# EasyEDA schematic soap-disp-mega-16.json

## Sheets
1 Computer: TITLE: Sheet_1; REV: 1.0; Date: 2021-05-28; Sheet: 1/1; Drawn By: Suresh Kumar Gadi; Company: Your Company
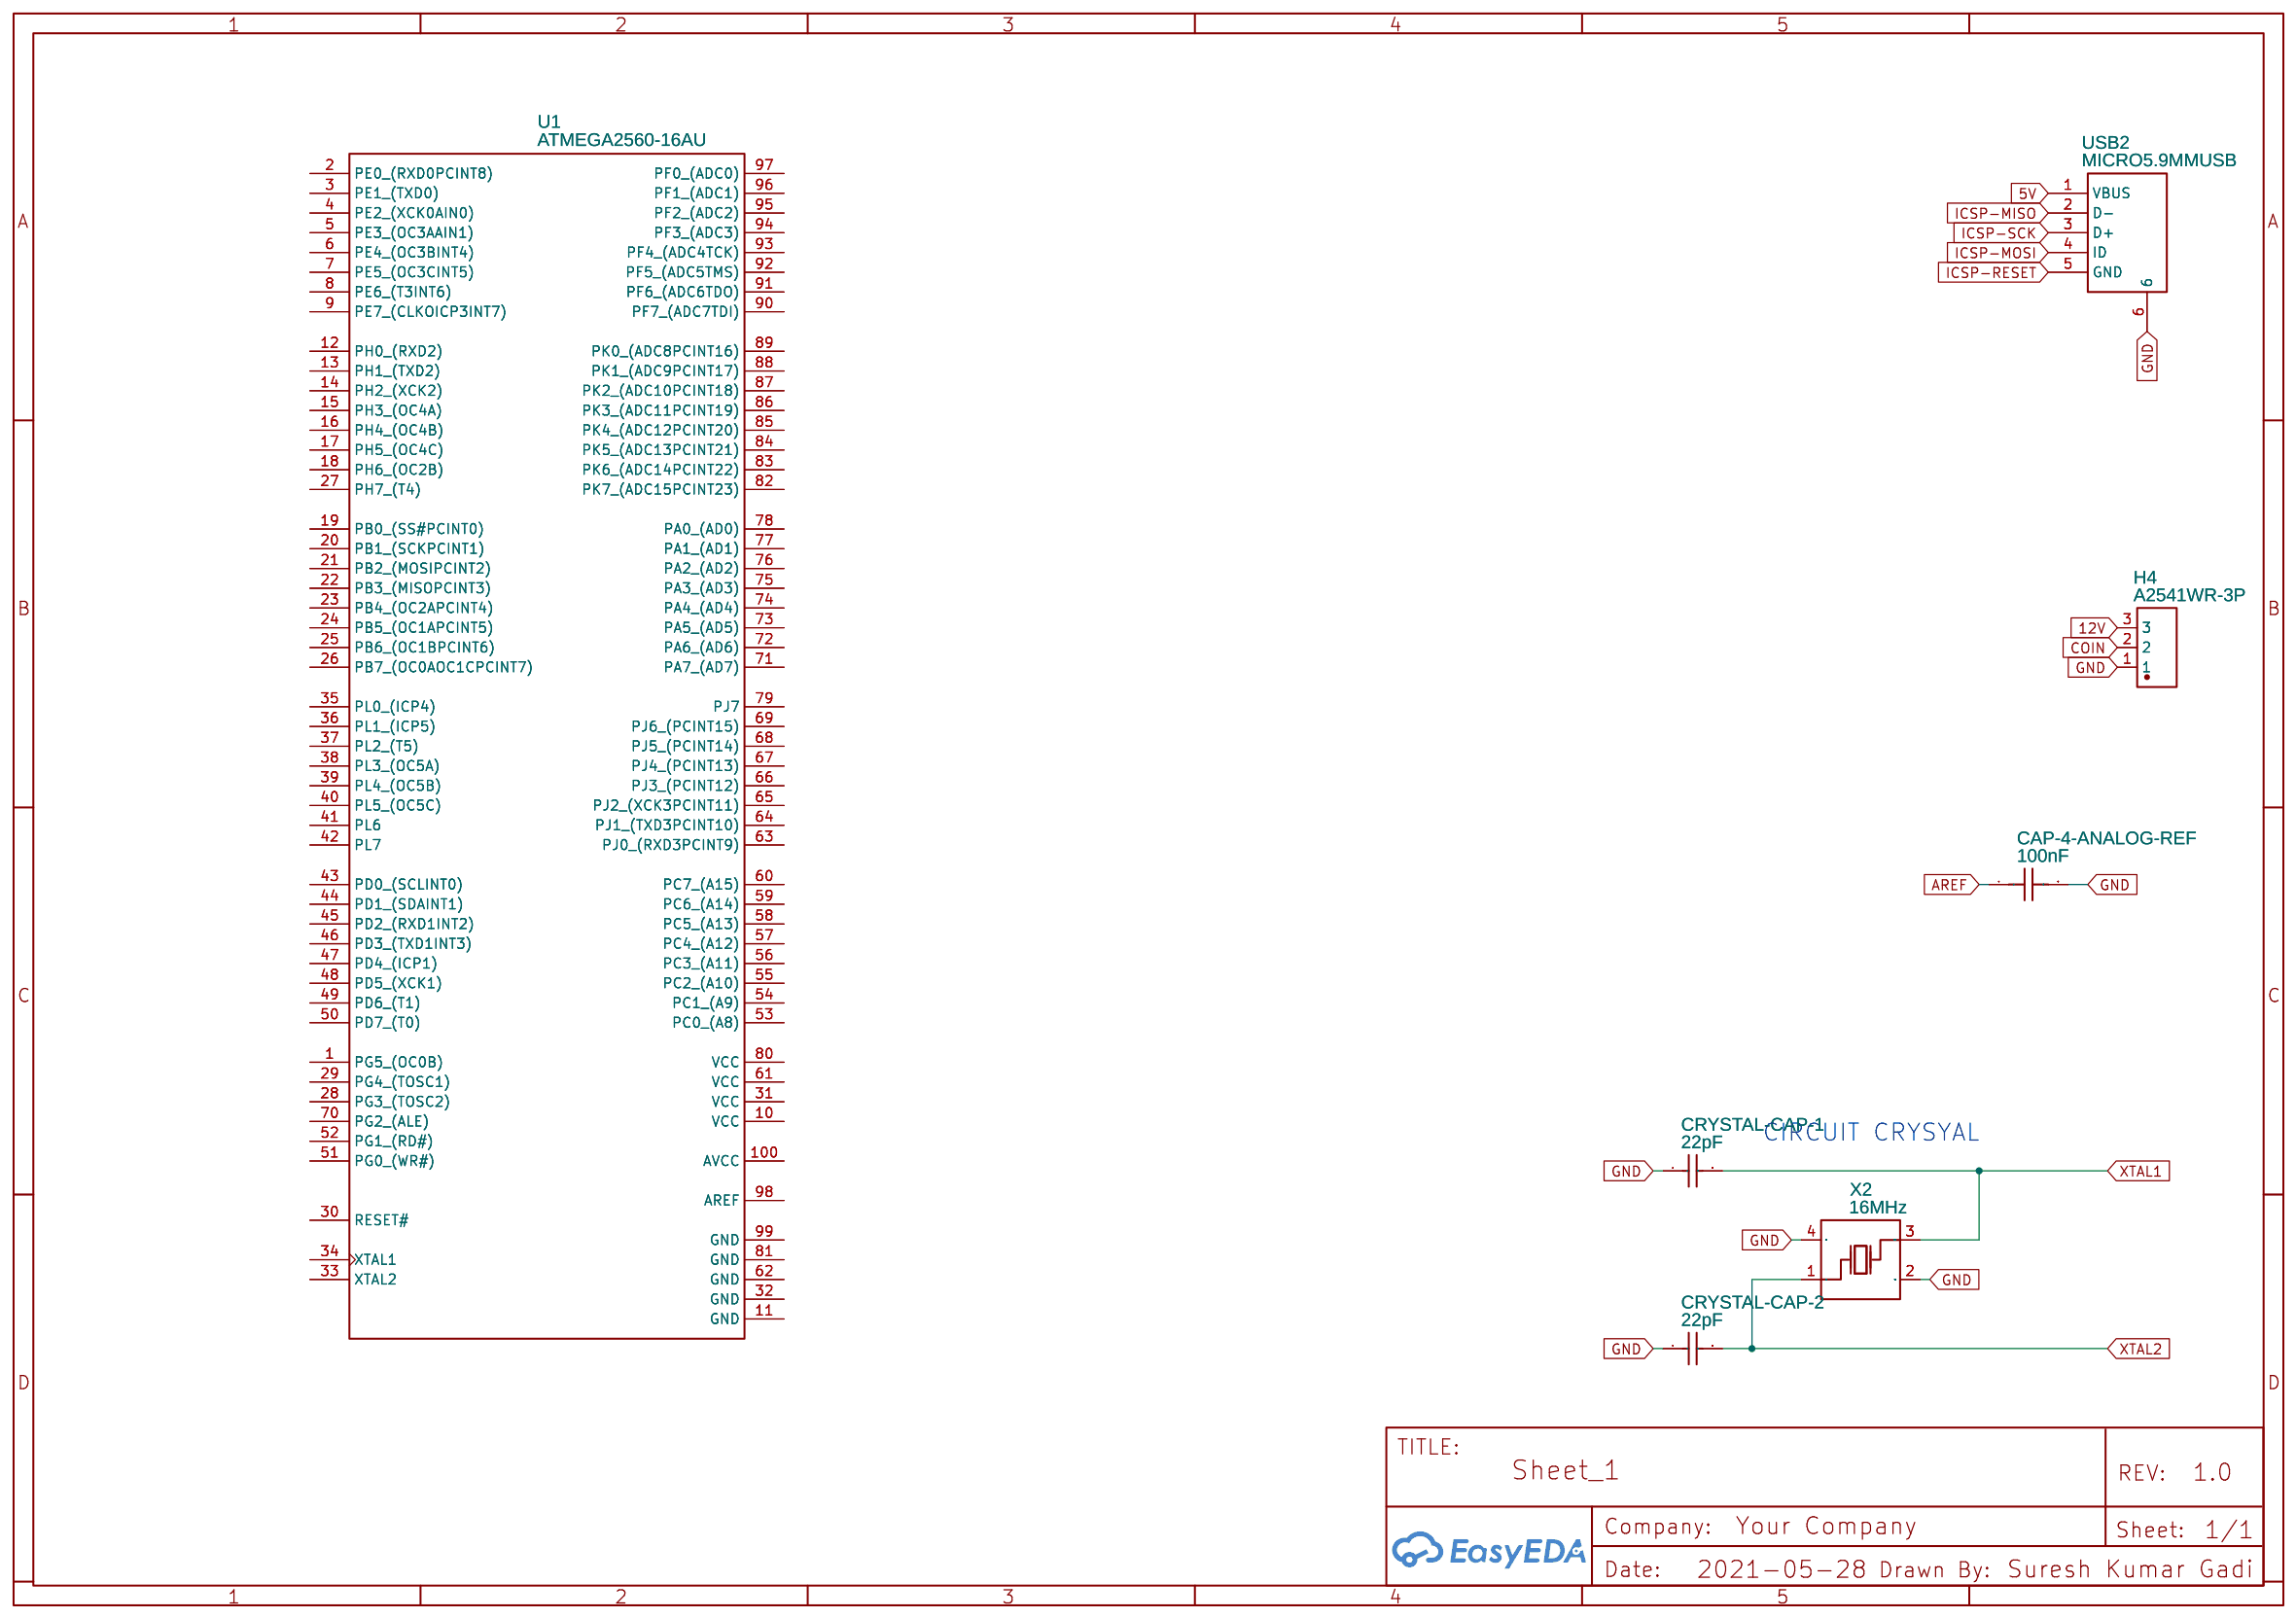
[diagram p0: Computer]
2 Connectors
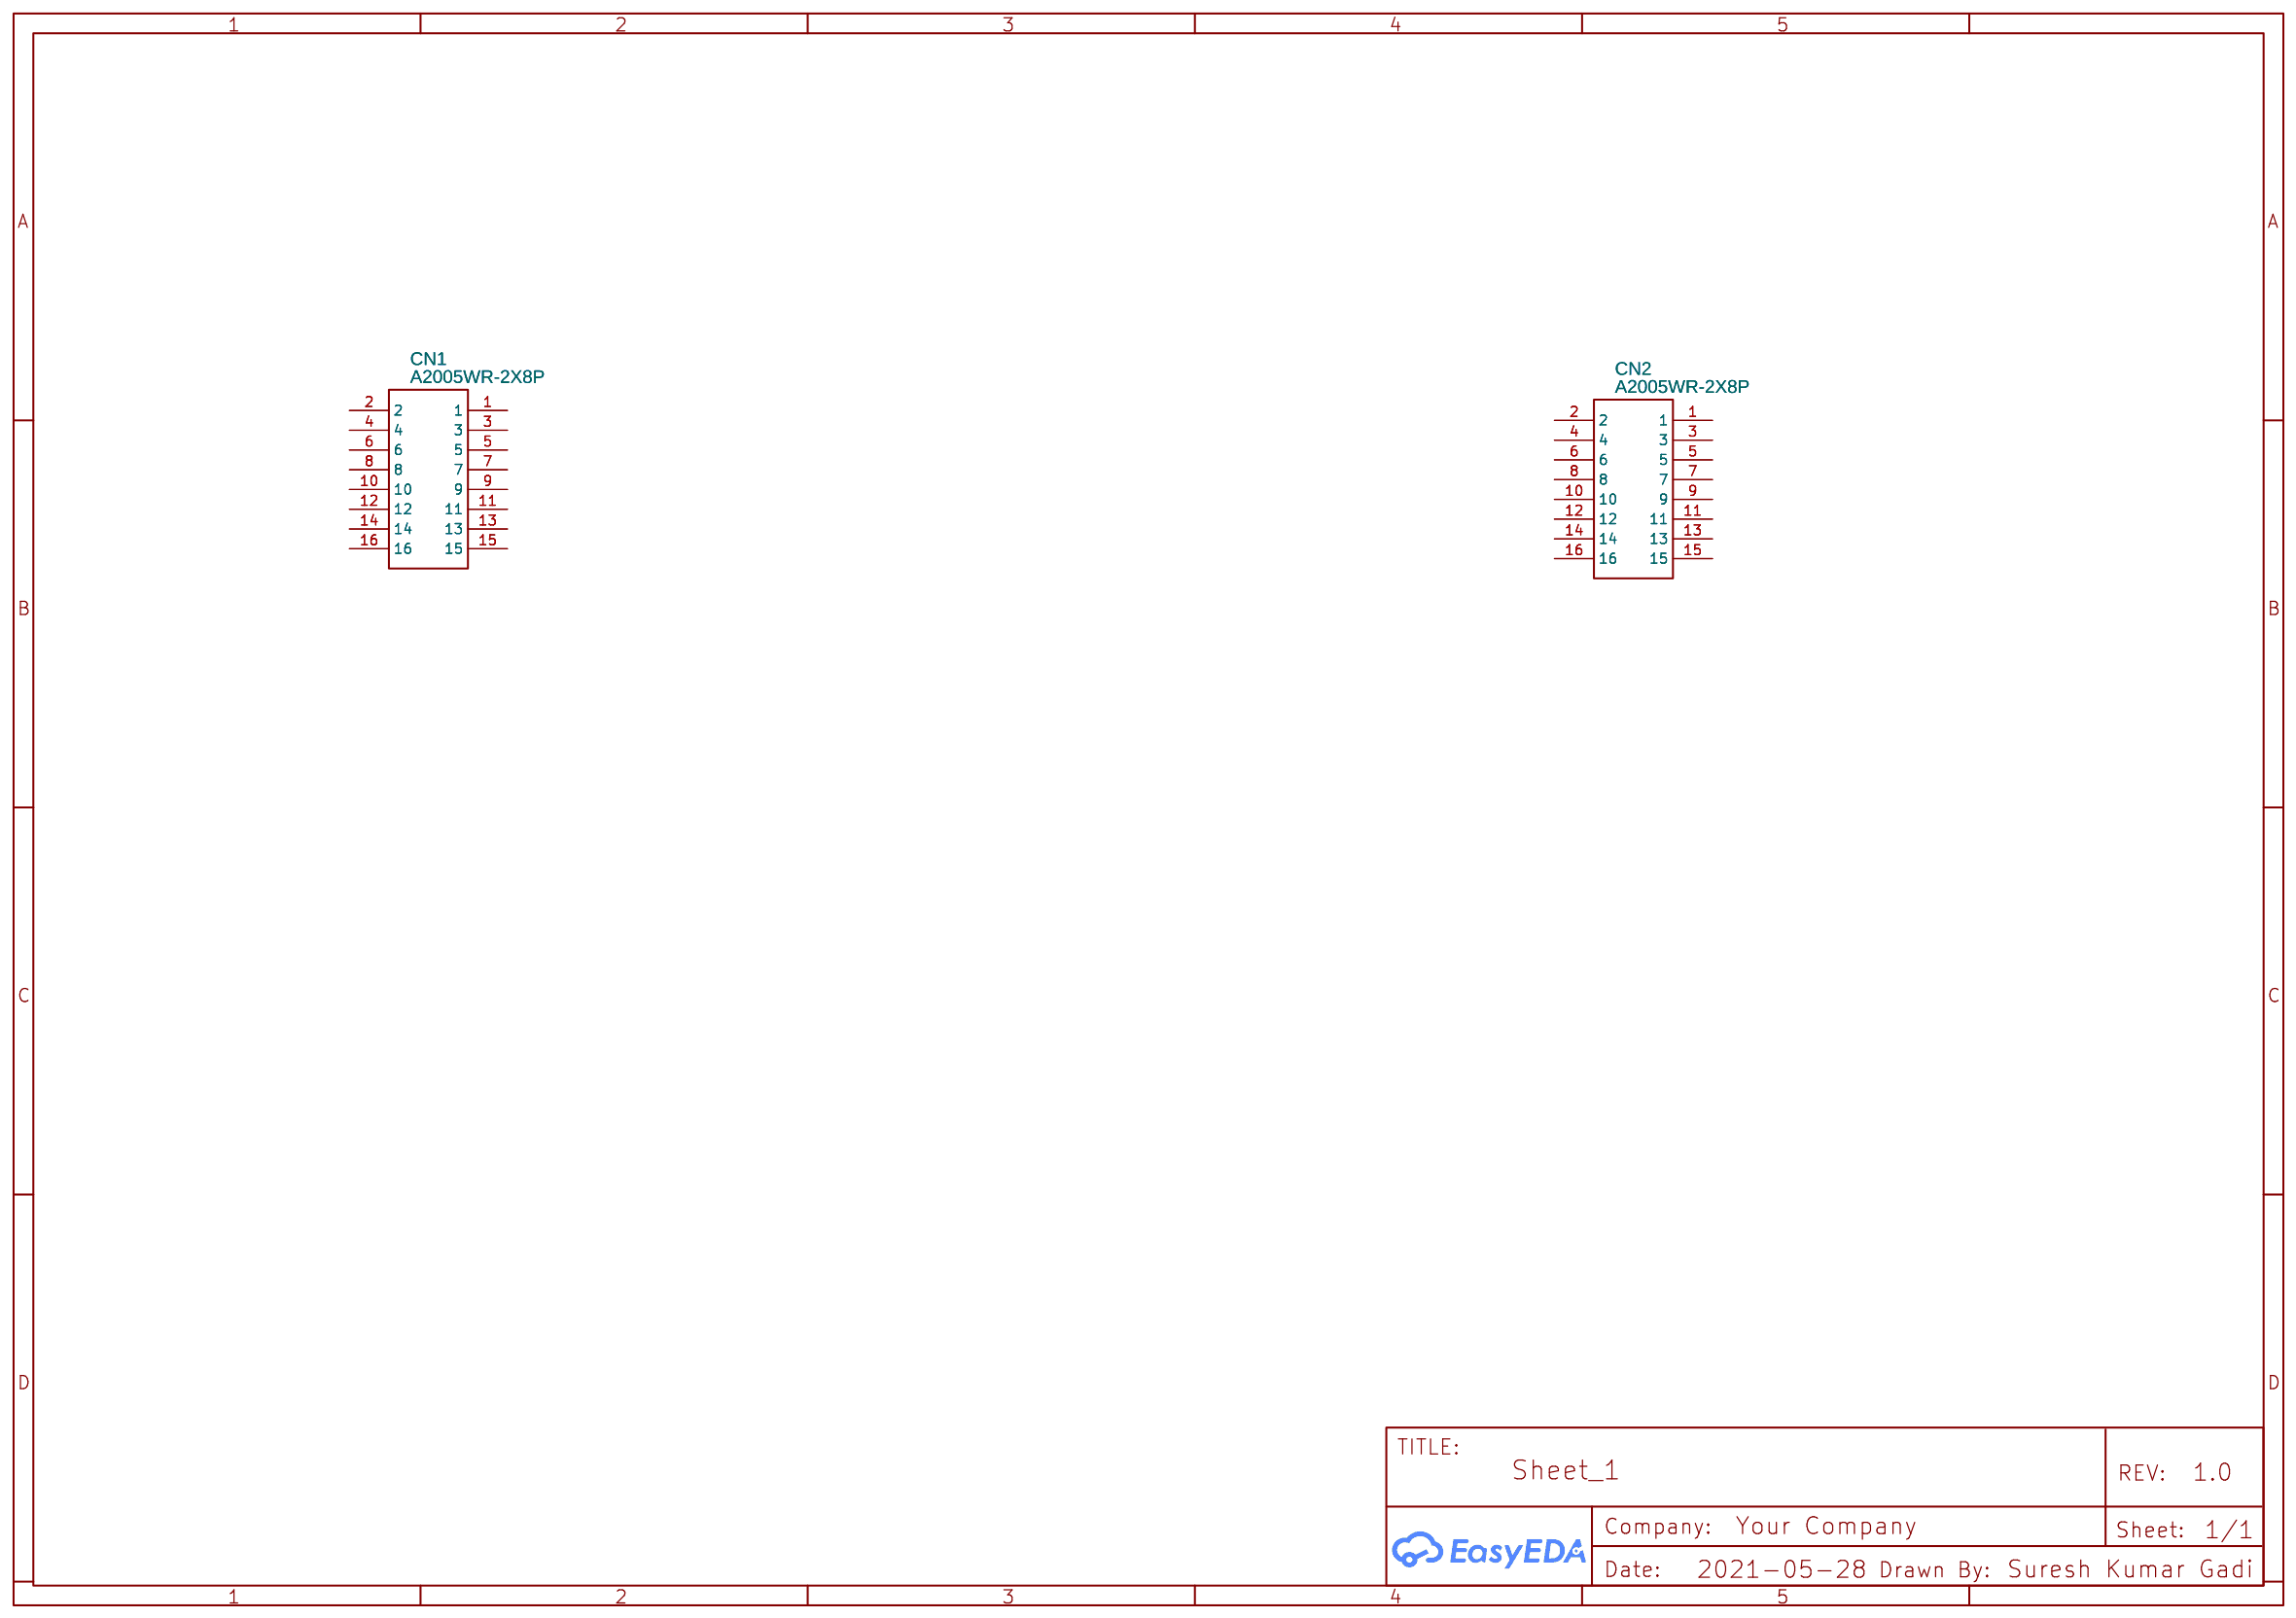
[diagram p1: Connectors]
3 SD
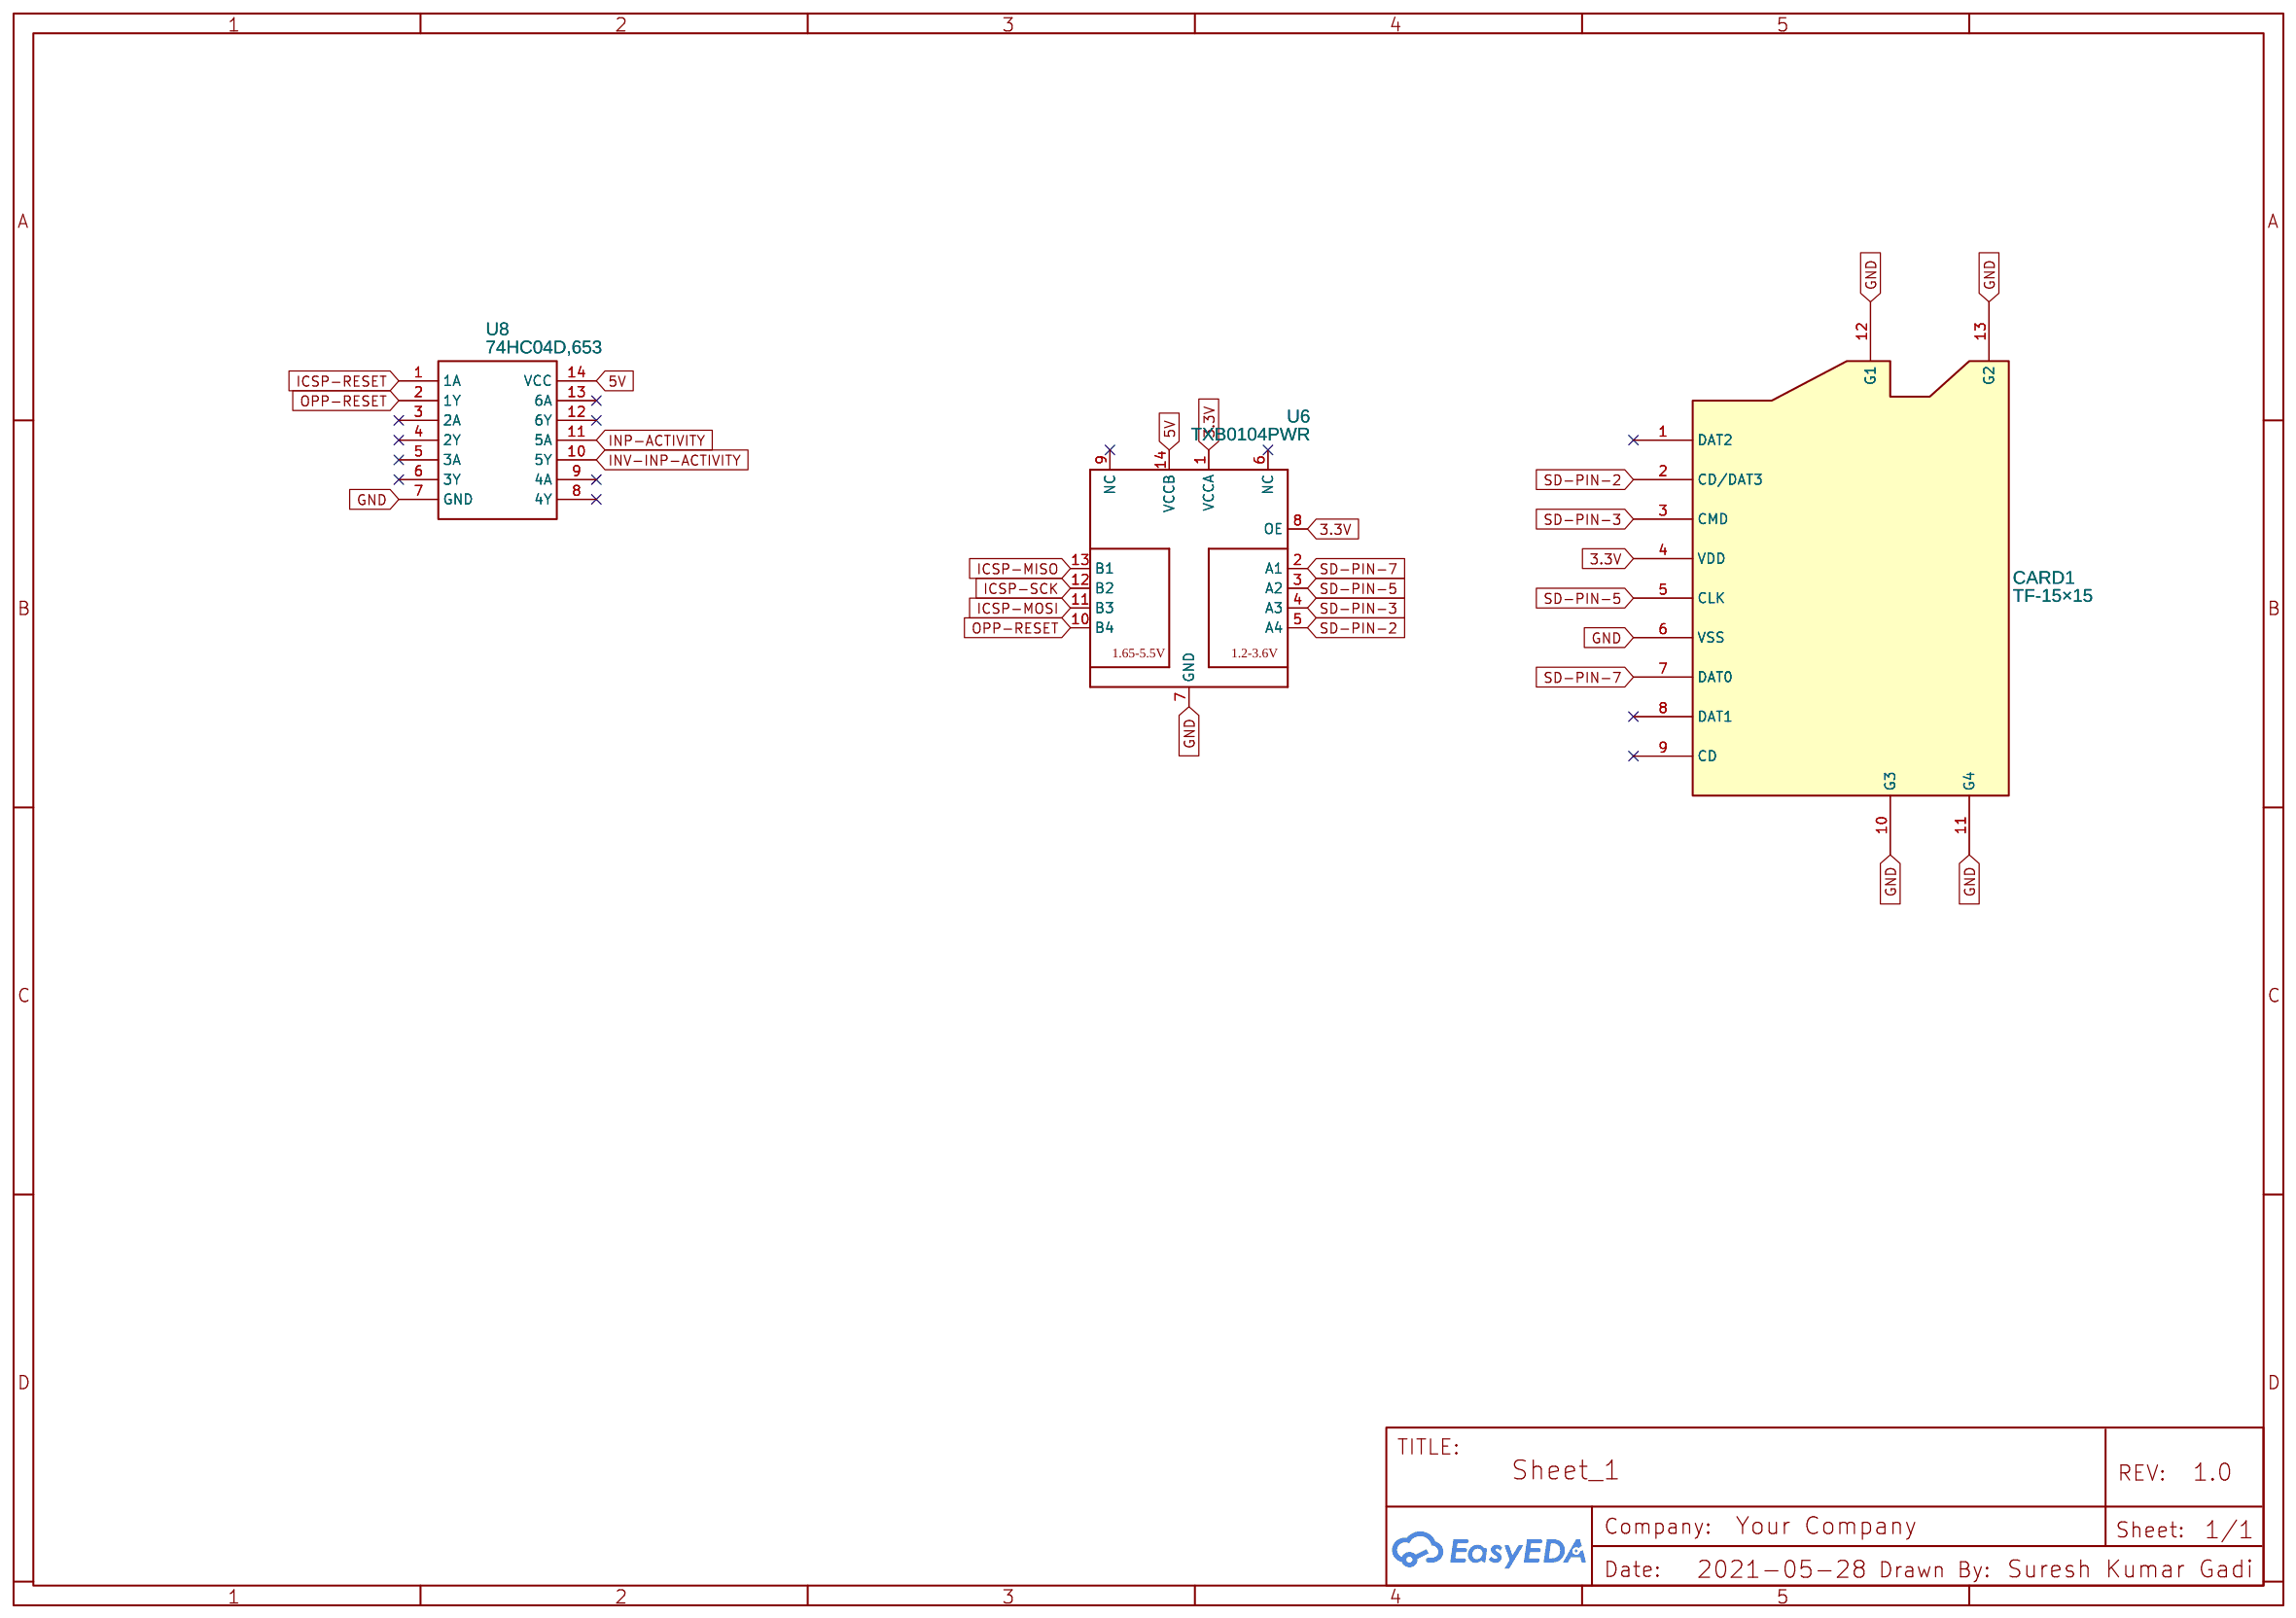
[diagram p2: SD]
4 Power
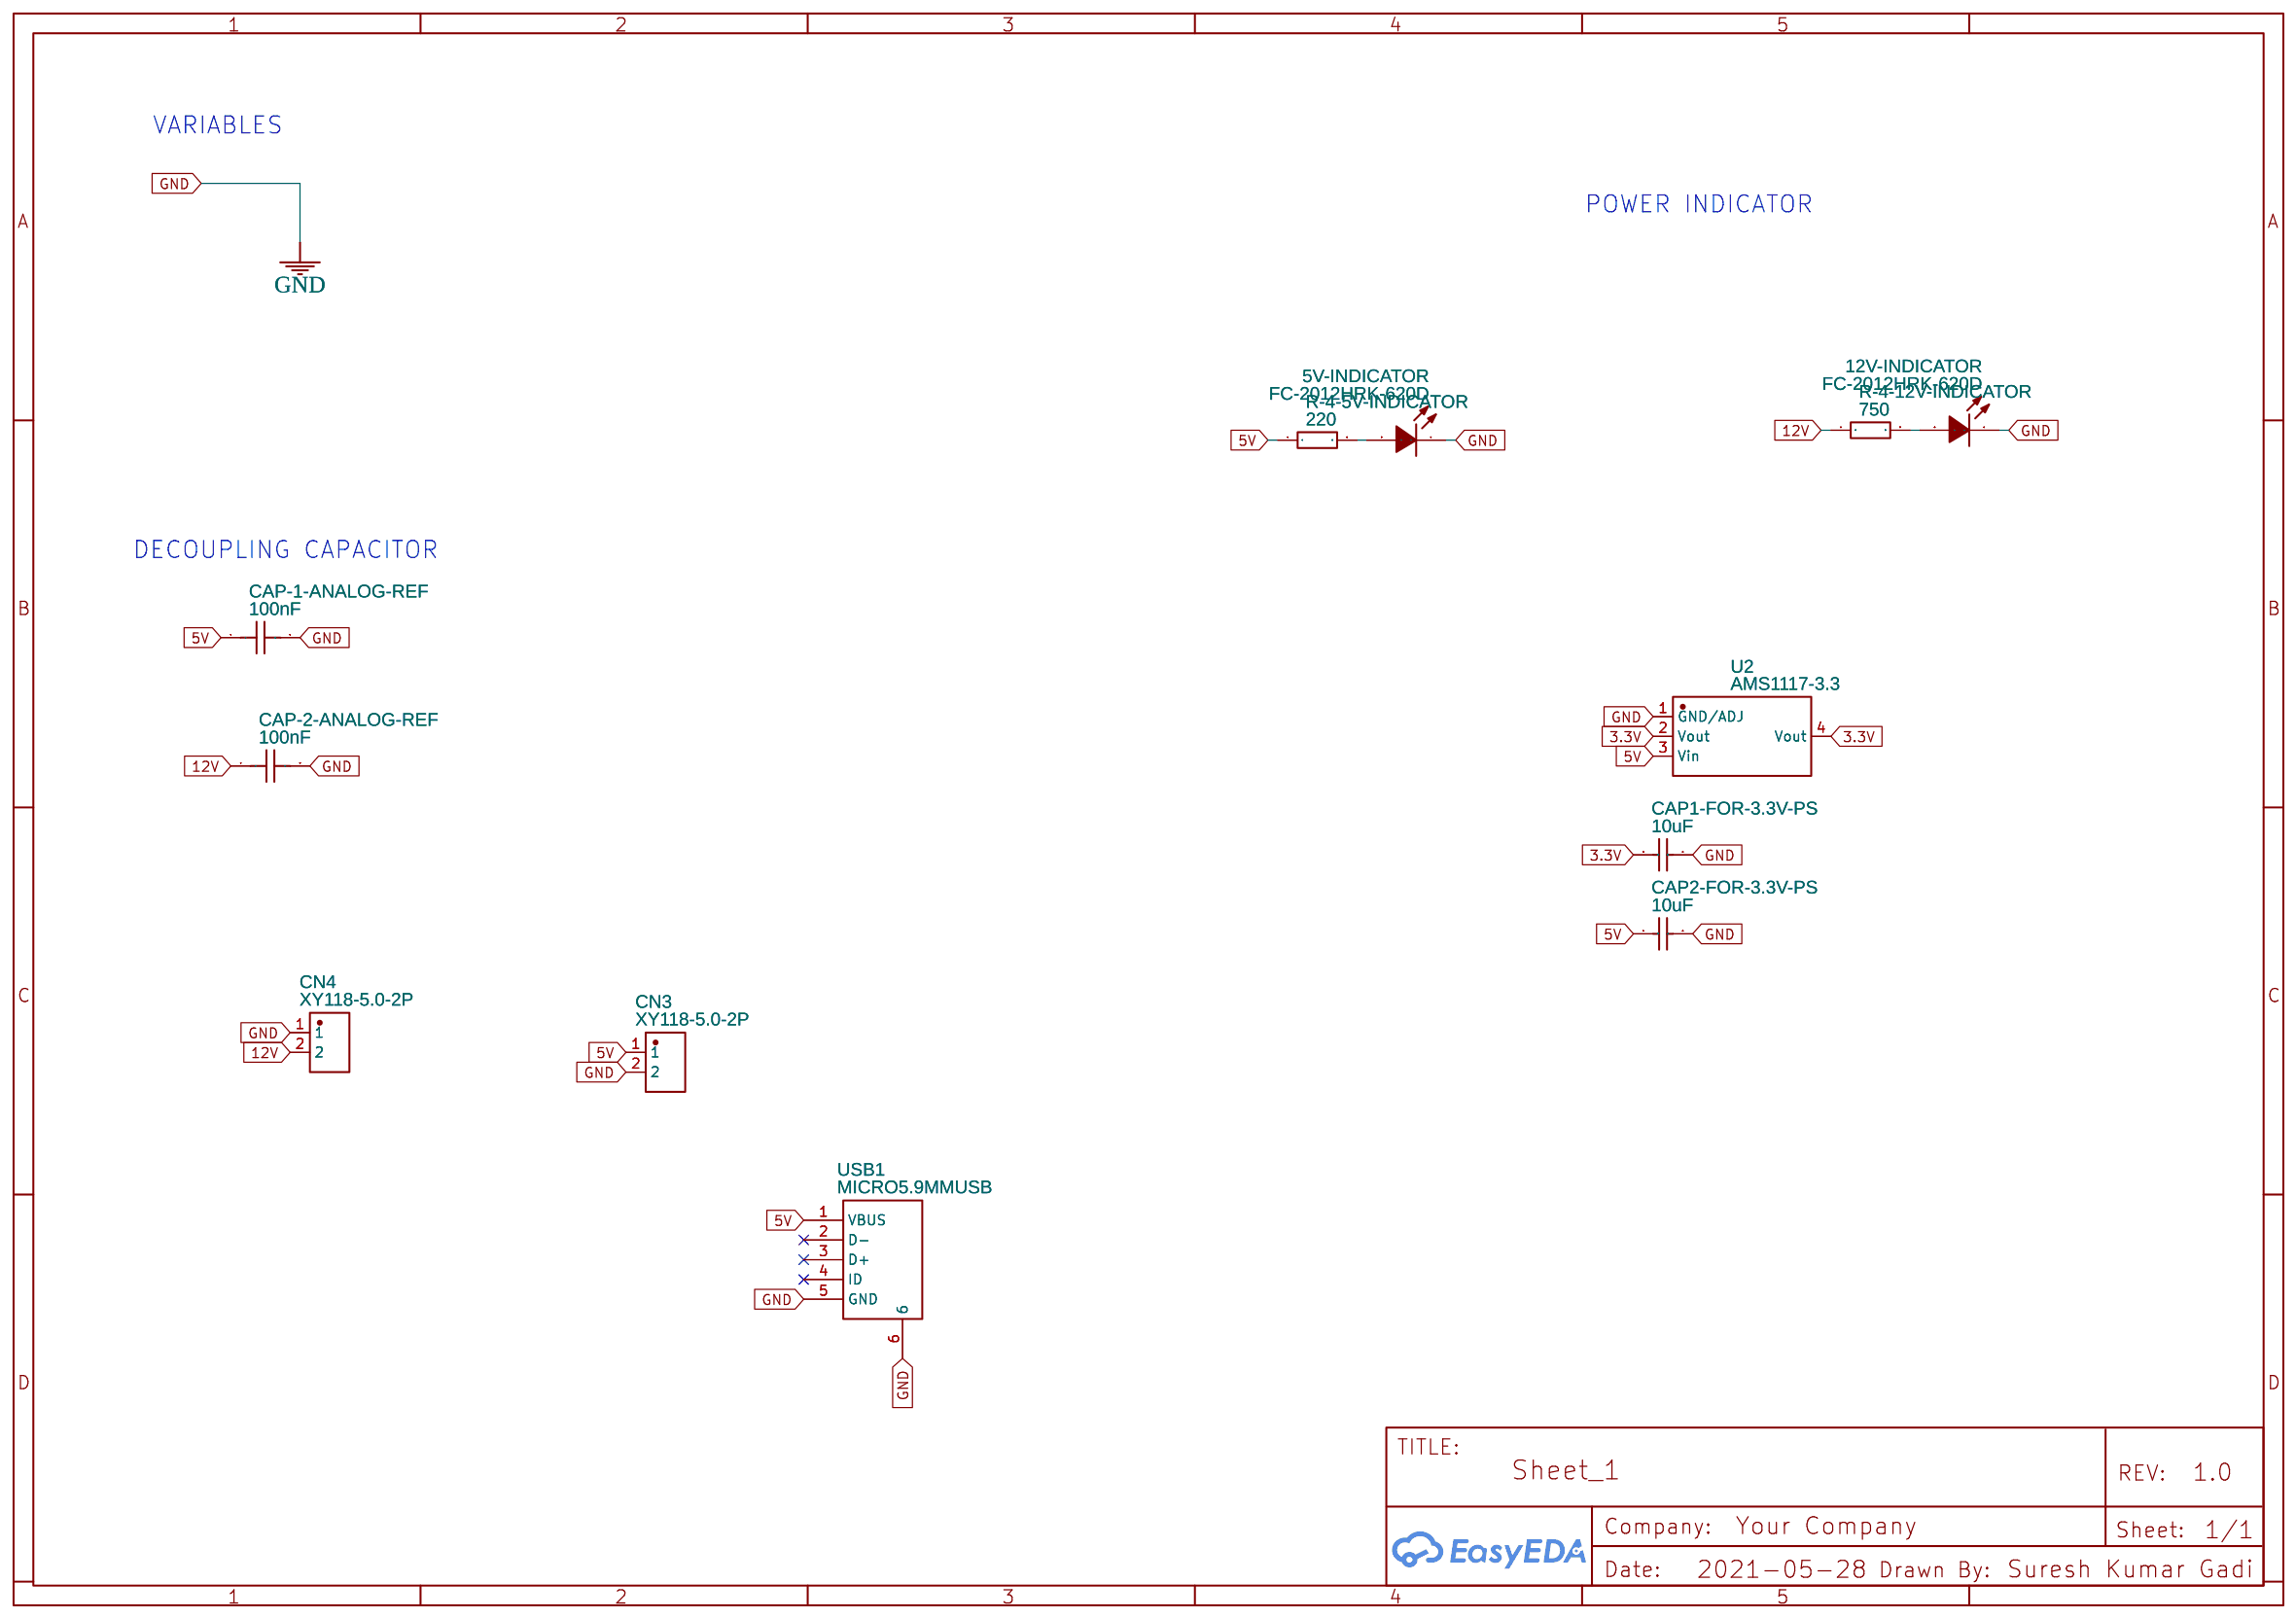
[diagram p3: Power]
5 Capacitors
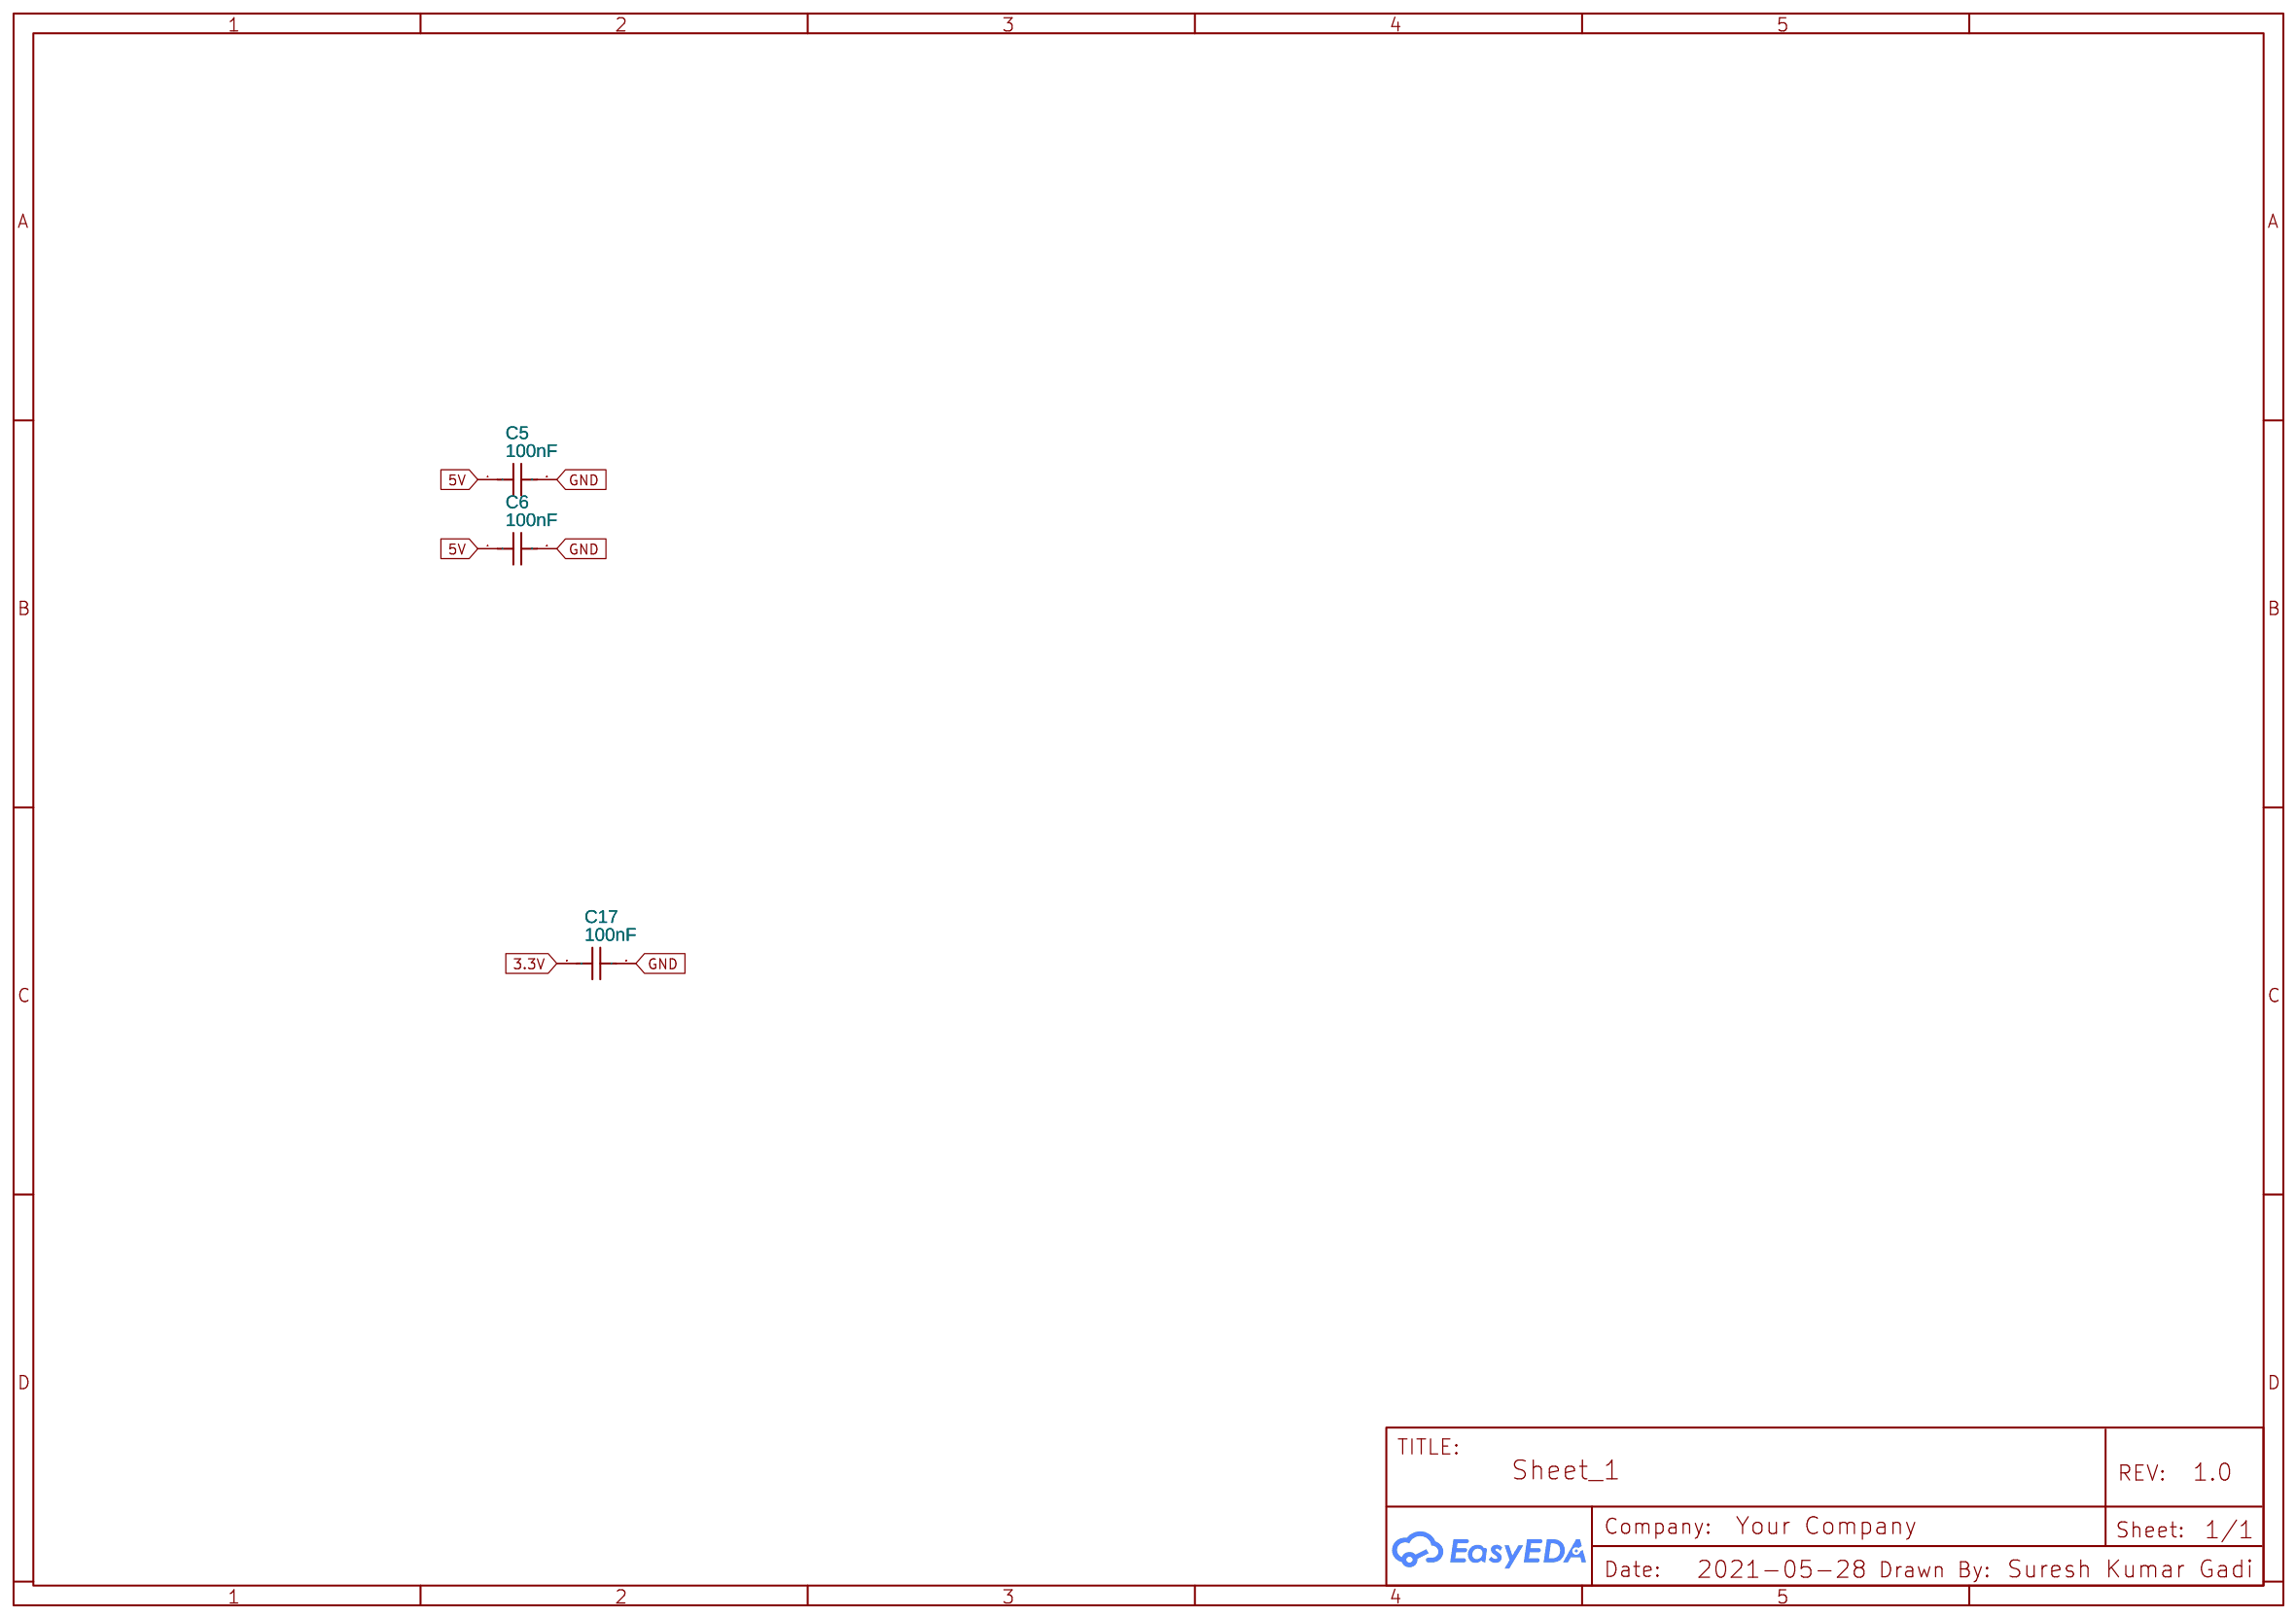
[diagram p4: Capacitors]
6 Display
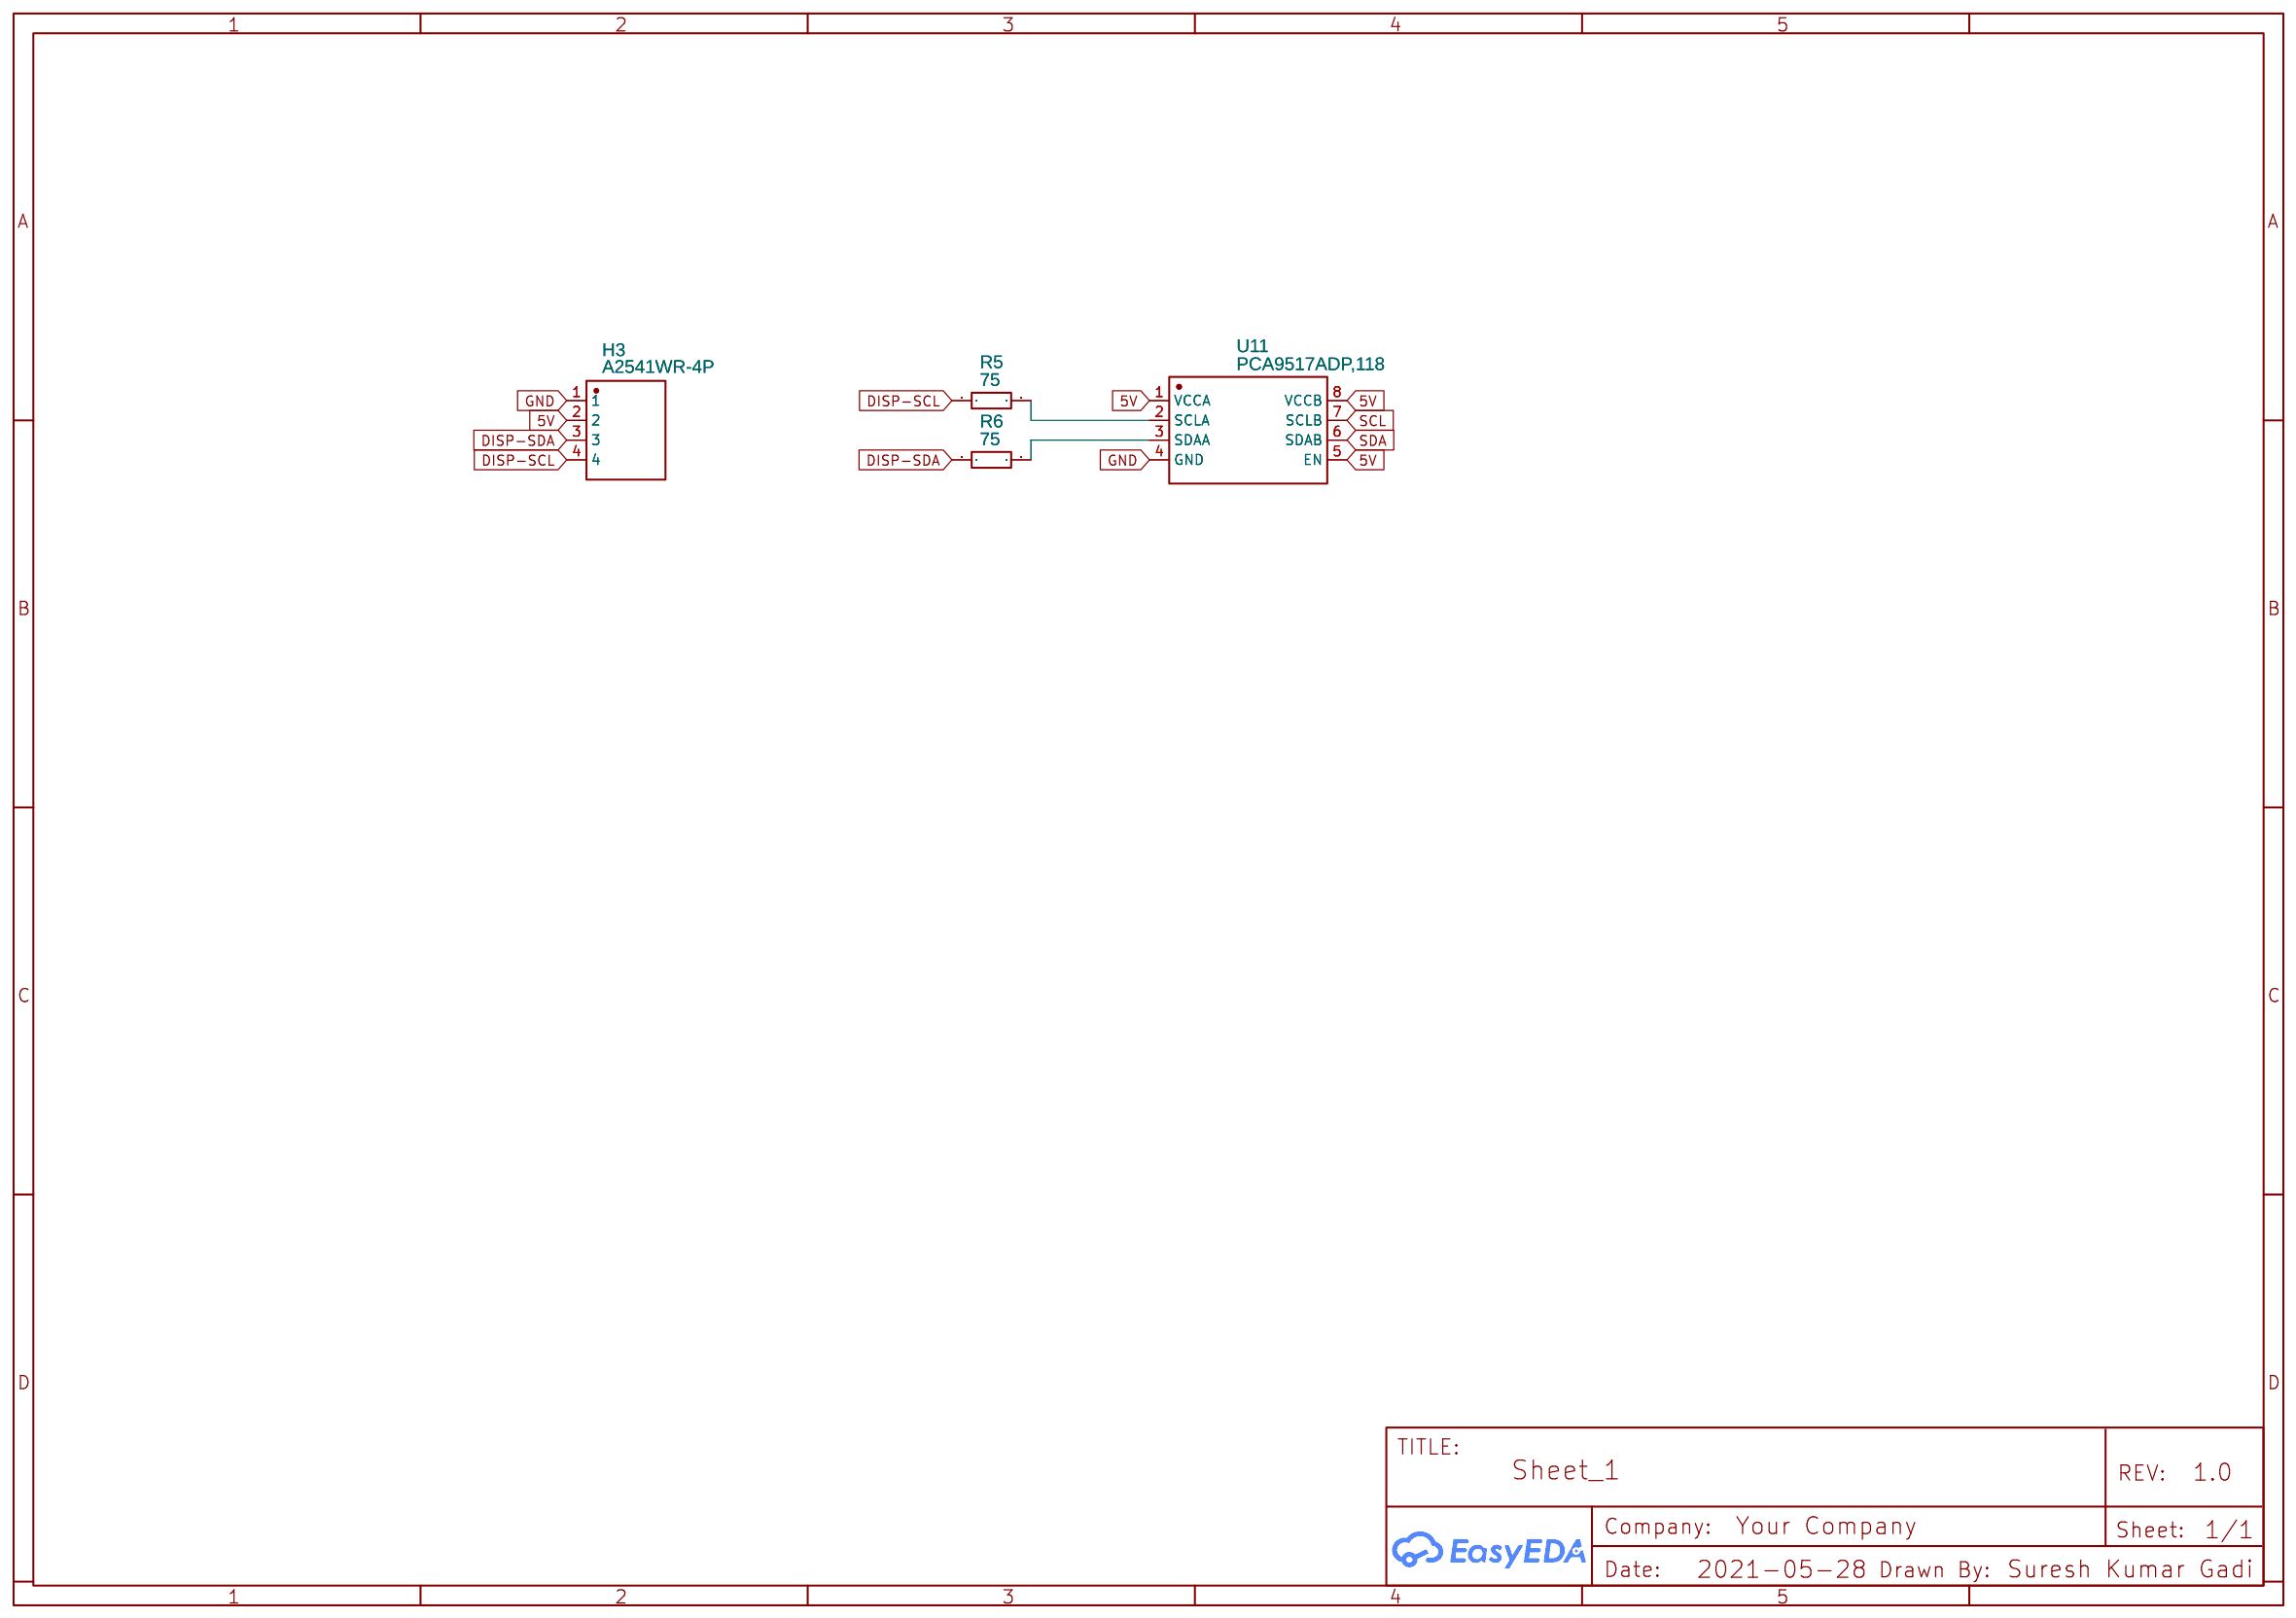
[diagram p5: Display]
7 LEDs
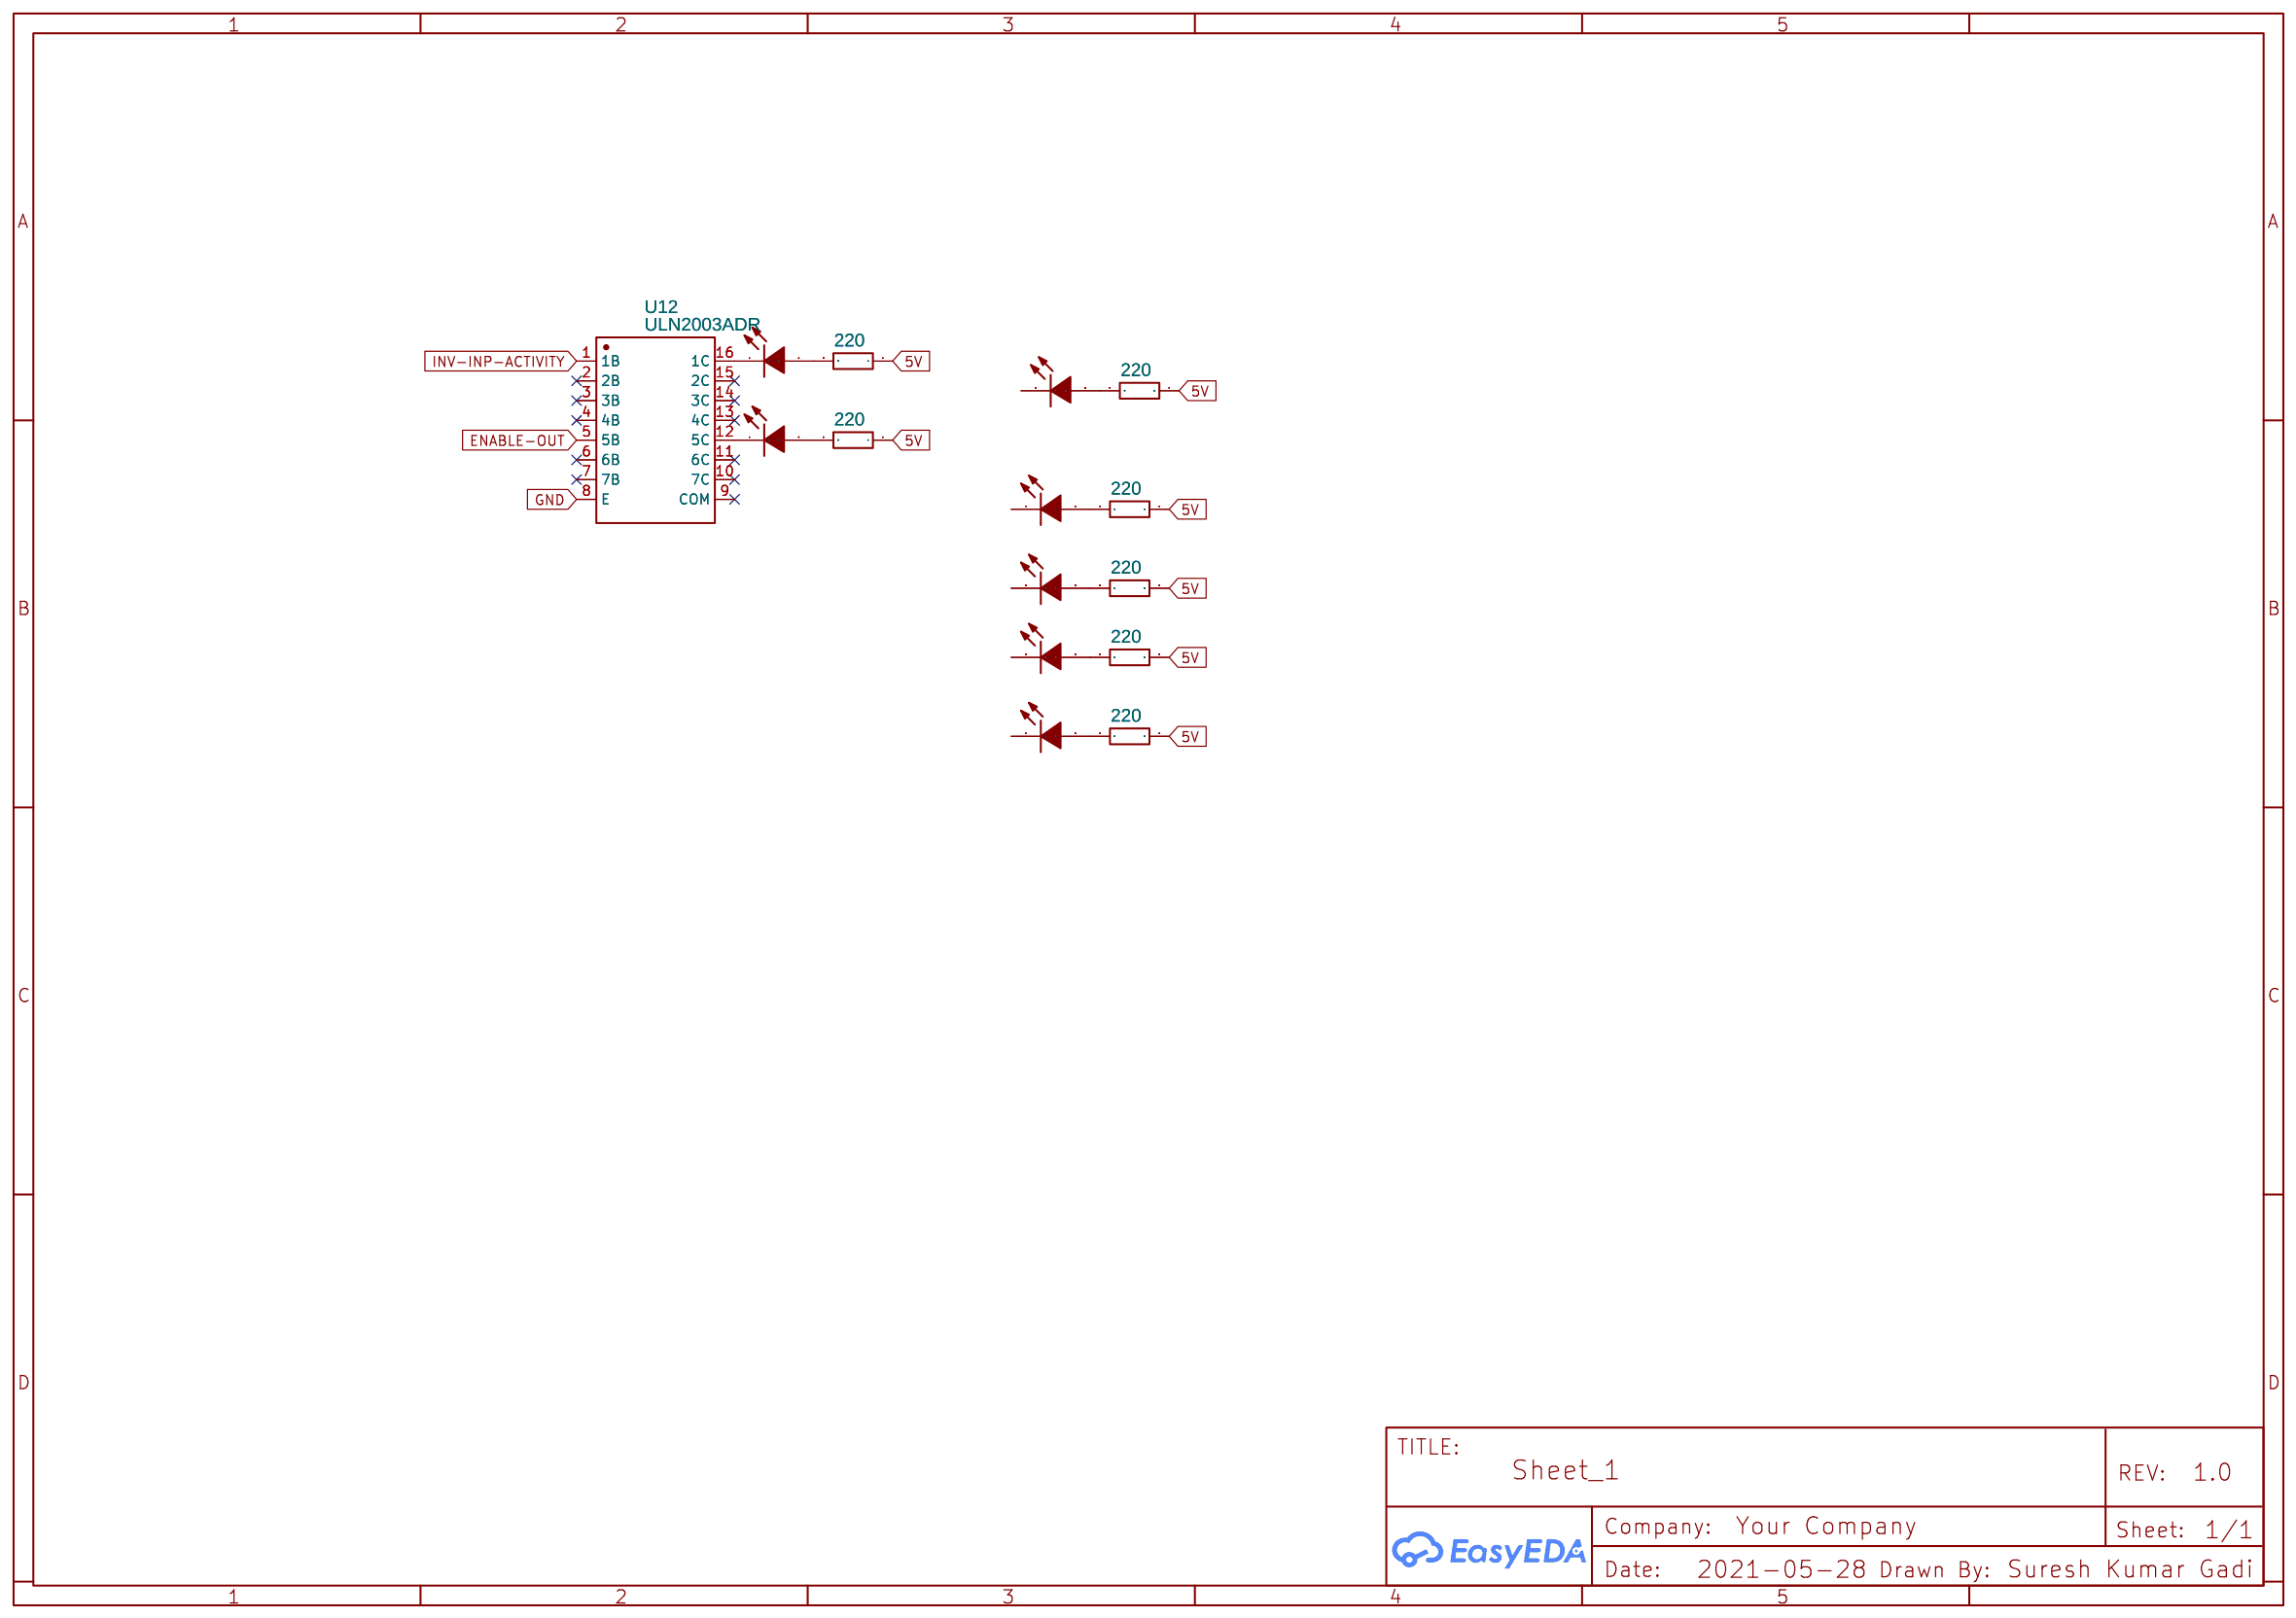
[diagram p6: LEDs]

## Parts
sheet Capacitors
C5  100nF  [C0603]
C6  100nF  [C0603]
C17  100nF  [C0603]
sheet Computer
CAP-4-ANALOG-REF  100nF  [C0603]
CRYSTAL-CAP-1  22pF  [C0805]
CRYSTAL-CAP-2  22pF  [C0805]
H4  A2541WR-3P  [HDR-TH_3P-P2.54-H-W10.0]
U1  ATMEGA2560-16AU  [TQFP-100_L14.0-W14.0-P0.50-LS16.0-BL]
USB2  MICRO5.9MMUSB  [MICRO-USB-SMD_5P-P0.65-H-F_MICRO5.9MMUSB]
X2  16MHz  [OSC-SMD_4P-L3.2-W2.5-BL]
sheet Connectors
CN1  A2005WR-2X8P  [HDR-TH_16P-P2.00-H-R2-C8-S2.00-W8.9]
CN2  A2005WR-2X8P  [HDR-TH_16P-P2.00-H-R2-C8-S2.00-W8.9]
sheet Display
H3  A2541WR-4P  [HDR-TH_4P-P2.54-H-W10.3]
R5  75  [R0402]
R6  75  [R0402]
U11  PCA9517ADP,118  [TSSOP-8_L3.0-W3.0-P0.65-LS4.9-BL]
sheet LEDs
ENAMEOUTINDICATOR1  FC-2012HRK-620D  [LED0805-RD]
ENAMEOUTINDICATOR2  FC-2012HRK-620D  [LED0805-RD]
ENAMEOUTINDICATOR3  FC-2012HRK-620D  [LED0805-RD]
ENAMEOUTINDICATOR4  FC-2012HRK-620D  [LED0805-RD]
INPUTACTIVITYINDICATOR1  FC-2012HRK-620D  [LED0805-RD]
INPUTACTIVITYINDICATOR2  FC-2012HRK-620D  [LED0805-RD]
INPUTACTIVITYINDICATOR3  FC-2012HRK-620D  [LED0805-RD]
R-4-1V-INDICATOR  220  [R0805]
R-4-2V-INDICATOR  220  [R0805]
R-4-3V-INDICATOR  220  [R0805]
RESFORENAMEOUTINDICATOR1  220  [R0805]
RESFORENAMEOUTINDICATOR2  220  [R0805]
RESFORENAMEOUTINDICATOR3  220  [R0805]
RESFORENAMEOUTINDICATOR4  220  [R0805]
U12  ULN2003ADR  [SOIC-16_L9.9-W3.9-P1.27-LS6.0-BL]
sheet Power
5V-INDICATOR  FC-2012HRK-620D  [LED0805-RD]
12V-INDICATOR  FC-2012HRK-620D  [LED0805-RD]
CAP1-FOR-3.3V-PS  10uF  [C0805]
CAP2-FOR-3.3V-PS  10uF  [C0805]
CAP-1-ANALOG-REF  100nF  [C0603]
CAP-2-ANALOG-REF  100nF  [C0603]
CN3  XY118-5.0-2P  [CONN-TH_XY118-5.0-2P]
CN4  XY118-5.0-2P  [CONN-TH_XY118-5.0-2P]
R-4-5V-INDICATOR  220  [R0805]
R-4-12V-INDICATOR  750  [R1206]
U2  AMS1117-3.3  [SOT-223-3_L6.5-W3.4-P2.30-LS7.0-BR]
USB1  MICRO5.9MMUSB  [MICRO-USB-SMD_5P-P0.65-H-F_MICRO5.9MMUSB]
sheet SD
CARD1  TF-15×15  [TF-SMD_TF-15-15]
U6  TXB0104PWR  [TSSOP-14_L5.0-W4.4-P0.65-LS6.4-BL]
U8  74HC04D,653  [SOIC-14_L8.7-W3.9-P1.27-LS6.0-BL]

## Library data of the parts
C5 C6 C17 = CC0603KRX7R9BB104: Supplier: LCSC; Manufacturer: YAGEO; Supplier Part: C14663; JLCPCB Part Class: Basic Part
CAP-1-ANALOG-REF CAP-2-ANALOG-REF CAP-4-ANALOG-REF = CC0603KRX7R9BB104: Supplier: LCSC; Manufacturer: YAGEO; Supplier Part: C14663; SMT Type: Basic; JLCPCB SMD: Yes; LCSC Assembly: Yes; Paste Type: base
CRYSTAL-CAP-1 CRYSTAL-CAP-2 = CL21C220JBANNNC: Supplier: LCSC; Manufacturer: SAMSUNG; Supplier Part: C1804; SMT Type: Basic; JLCPCB SMD: Yes; LCSC Assembly: Yes; Paste Type: base
H4 = A2541WR-3P: Supplier: LCSC; Supplier Part: C225489; Manufacturer: Changjiang Connectors; Contributor: LCSC; JLCPCB Part Class: Extended Part
U1 = ATMEGA2560-16AU: Supplier: LCSC; Manufacturer: MICROCHIP; Supplier Part: C22460; JLCPCB Part Class: Extended Part
USB1 USB2 = MICRO5.9MMUSB: Supplier: LCSC; Supplier Part: C393940; Manufacturer: SHOU HAN; Manufacturer Part: MICRO5.9mmusb; Contributor: LCSC
X2 = X322516MLB4SI: Supplier: LCSC; Manufacturer: YXC; Supplier Part: C13738; SMT Type: Basic; JLCPCB SMD: Yes; LCSC Assembly: Yes; Paste Type: base
CN1 CN2 = A2005WR-2X8P: Supplier: LCSC; Supplier Part: C225300; Manufacturer: Changjiang Connectors; Manufacturer Part: A2005WR-2x8P; Contributor: LCSC; JLCPCB Part Class: Extended Part
H3 = A2541WR-4P: Supplier: LCSC; Supplier Part: C225490; Manufacturer: Changjiang Connectors; Contributor: LCSC; JLCPCB Part Class: Extended Part
R5 R6 = 0402WGF750JTCE: Supplier: LCSC; Manufacturer: UniOhm; Supplier Part: C25133; JLCPCB Part Class: Basic Part
U11 = PCA9517ADP,118: Supplier: LCSC; Manufacturer: NXP; image: //image.lceda.cn/szlcsc/C80799.jpg; Supplier Part: C80799; JLCPCB Part Class: Extended Part
5V-INDICATOR 12V-INDICATOR ENAMEOUTINDICATOR1-ENAMEOUTINDICATOR4 INPUTACTIVITYINDICATOR1-INPUTACTIVITYINDICATOR3 = FC-2012HRK-620D: Supplier: LCSC; Manufacturer: NATIONSTAR; image: //image.lceda.cn/szlcsc/C84256.jpg; Supplier Part: C84256; SMT Type: Basic; JLCPCB SMD: Yes; LCSC Assembly: Yes; Paste Type: base
R-4-1V-INDICATOR R-4-2V-INDICATOR R-4-3V-INDICATOR R-4-5V-INDICATOR RESFORENAMEOUTINDICATOR1-RESFORENAMEOUTINDICATOR4 = 0805W8F2200T5E: Supplier: LCSC; Manufacturer: UniOhm; Supplier Part: C17557; SMT Type: Basic; JLCPCB SMD: Yes; LCSC Assembly: Yes; Paste Type: base
U12 = ULN2003ADR: Supplier: LCSC; Manufacturer: TI; image: //image.lceda.cn/szlcsc/C7512.jpg; Supplier Part: C7512; JLCPCB Part Class: Basic Part
CAP1-FOR-3.3V-PS CAP2-FOR-3.3V-PS = CL21A106KAYNNNE: Supplier: LCSC; Manufacturer: SAMSUNG; Supplier Part: C15850; SMT Type: Basic; JLCPCB SMD: Yes; LCSC Assembly: Yes; Paste Type: base
CN3 CN4 = XY118-5.0-2P: Supplier: LCSC; Supplier Part: C784922; Manufacturer: Ningbo Xinlaiya Elec.; Contributor: LCSC; LCSC Assembly: Yes; SMT Type: Extend; Paste Type: expand
R-4-12V-INDICATOR = 1206W4F7500T5E: Supplier: LCSC; Manufacturer: UniOhm; Supplier Part: C17985; SMT Type: Basic; JLCPCB SMD: Yes; LCSC Assembly: Yes; Paste Type: base
U2 = AMS1117-3.3: sourceId: dwIGgezVh; Supplier: LCSC; Manufacturer: AMS; image: //image.lceda.cn/szlcsc/C6186.jpg; Supplier Part: C6186; SMT Type: Basic; JLCPCB SMD: Yes; LCSC Assembly: Yes; Paste Type: base
CARD1 = TF-15×15: Supplier: LCSC; Manufacturer: SOFNG; Supplier Part: C111196
U6 = TXB0104PWR: Supplier: LCSC; Manufacturer: TI; Supplier Part: C60708; SMT Type: Extend; JLCPCB SMD: Yes; Paste Type: recommend
U8 = 74HC04D,653: Supplier: LCSC; Manufacturer: Nexperia; image: //image.lceda.cn/szlcsc/C5590.jpg; Supplier Part: C5590; SMT Type: Basic; JLCPCB SMD: Yes; LCSC Assembly: Yes; Paste Type: base

## Nets
3.3V: C17.1 CAP1-FOR-3.3V-PS.1 CARD1.4(VDD) U2.2(Vout) U2.4(Vout) U6.1(VCCA) U6.8(OE)
5V: C5.1 C6.1 CAP2-FOR-3.3V-PS.1 CAP-1-ANALOG-REF.1 CN3.1 H3.2 R-4-1V-INDICATOR.1 R-4-2V-INDICATOR.1 R-4-3V-INDICATOR.1 R-4-5V-INDICATOR.1 RESFORENAMEOUTINDICATOR1.1 RESFORENAMEOUTINDICATOR2.1 RESFORENAMEOUTINDICATOR3.1 RESFORENAMEOUTINDICATOR4.1 U2.3(Vin) U6.14(VCCB) U8.14(VCC) U11.1(VCCA) U11.5(EN) U11.8(VCCB) USB1.1(VBUS) USB2.1(VBUS)
12V: CAP-2-ANALOG-REF.1 CN4.2 H4.3 R-4-12V-INDICATOR.1
GND: 5V-INDICATOR.1(-) 12V-INDICATOR.1(-) C5.2 C6.2 C17.2 CAP1-FOR-3.3V-PS.2 CAP2-FOR-3.3V-PS.2 CAP-1-ANALOG-REF.2 CAP-2-ANALOG-REF.2 CAP-4-ANALOG-REF.2 CARD1.6(VSS) CARD1.10(G3) CARD1.11(G4) CARD1.12(G1) CARD1.13(G2) CN3.2 CN4.1 CRYSTAL-CAP-1.1 CRYSTAL-CAP-2.1 H3.1 H4.1 U2.1(GND/ADJ) U6.7(GND) U8.7(GND) U11.4(GND) U12.8(E) USB1.5(GND) USB1.6 USB2.6 X2.2(GND) X2.4(GND)
AREF: CAP-4-ANALOG-REF.1
COIN: H4.2
DISP-SCL: H3.4 R5.1
DISP-SDA: H3.3 R6.1
ENABLE-OUT: U12.5(5B)
ICSP-MISO: U6.13(B1) USB2.2(D-)
ICSP-MOSI: U6.11(B3) USB2.4(ID)
ICSP-RESET: U8.1(1A) USB2.5(GND)
ICSP-SCK: U6.12(B2) USB2.3(D+)
INP-ACTIVITY: U8.11(5A)
INV-INP-ACTIVITY: U8.10(5Y) U12.1(1B)
OPP-RESET: U6.10(B4) U8.2(1Y)
SCL: U11.7(SCLB)
SD-PIN-2: CARD1.2(CD/DAT3) U6.5(A4)
SD-PIN-3: CARD1.3(CMD) U6.4(A3)
SD-PIN-5: CARD1.5(CLK) U6.3(A2)
SD-PIN-7: CARD1.7(DAT0) U6.2(A1)
SDA: U11.6(SDAB)
XTAL1: CRYSTAL-CAP-1.2 X2.3(OSC2)
XTAL2: CRYSTAL-CAP-2.2 X2.1(OSC1)
Net-(5V-INDICATOR-2): 5V-INDICATOR.2(+) R-4-5V-INDICATOR.2
Net-(12V-INDICATOR-2): 12V-INDICATOR.2(+) R-4-12V-INDICATOR.2
Net-(ENAMEOUTINDICATOR1-1): ENAMEOUTINDICATOR1.1(-) U12.12(5C)
Net-(ENAMEOUTINDICATOR1-2): ENAMEOUTINDICATOR1.2(+) RESFORENAMEOUTINDICATOR1.2
Net-(ENAMEOUTINDICATOR2-2): ENAMEOUTINDICATOR2.2(+) RESFORENAMEOUTINDICATOR2.2
Net-(ENAMEOUTINDICATOR3-2): ENAMEOUTINDICATOR3.2(+) RESFORENAMEOUTINDICATOR3.2
Net-(ENAMEOUTINDICATOR4-2): ENAMEOUTINDICATOR4.2(+) RESFORENAMEOUTINDICATOR4.2
Net-(INPUTACTIVITYINDICATOR1-1): INPUTACTIVITYINDICATOR1.1(-) U12.16(1C)
Net-(INPUTACTIVITYINDICATOR1-2): INPUTACTIVITYINDICATOR1.2(+) R-4-1V-INDICATOR.2
Net-(INPUTACTIVITYINDICATOR2-2): INPUTACTIVITYINDICATOR2.2(+) R-4-2V-INDICATOR.2
Net-(INPUTACTIVITYINDICATOR3-2): INPUTACTIVITYINDICATOR3.2(+) R-4-3V-INDICATOR.2
Net-(R5-2): R5.2 U11.2(SCLA)
Net-(R6-2): R6.2 U11.3(SDAA)

Not connected (* = marked no-connect by the designer): CARD1 1(DAT2)* 8(DAT1)* 9(CD)*; CN1 1 2 3 4 5 6 7 8 9 10 11 12 13 14 15 16; CN2 1 2 3 4 5 6 7 8 9 10 11 12 13 14 15 16; ENAMEOUTINDICATOR2 1(-); ENAMEOUTINDICATOR3 1(-); ENAMEOUTINDICATOR4 1(-); INPUTACTIVITYINDICATOR2 1(-); INPUTACTIVITYINDICATOR3 1(-); U1 1(PG5 (OC0B)) 2(PE0 (RXD0PCINT8)) 3(PE1 (TXD0)) 4(PE2 (XCK0AIN0)) 5(PE3 (OC3AAIN1)) 6(PE4 (OC3BINT4)) 7(PE5 (OC3CINT5)) 8(PE6 (T3INT6)) 9(PE7 (CLKOICP3INT7)) 10(VCC) 11(GND) 12(PH0 (RXD2)) 13(PH1 (TXD2)) 14(PH2 (XCK2)) 15(PH3 (OC4A)) 16(PH4 (OC4B)) 17(PH5 (OC4C)) 18(PH6 (OC2B)) 19(PB0 (SS#PCINT0)) 20(PB1 (SCKPCINT1)) 21(PB2 (MOSIPCINT2)) 22(PB3 (MISOPCINT3)) 23(PB4 (OC2APCINT4)) 24(PB5 (OC1APCINT5)) 25(PB6 (OC1BPCINT6)) 26(PB7 (OC0AOC1CPCINT7)) 27(PH7 (T4)) 28(PG3 (TOSC2)) 29(PG4 (TOSC1)) 30(RESET#) 31(VCC) 32(GND) 33(XTAL2) 34(XTAL1) 35(PL0 (ICP4)) 36(PL1 (ICP5)) 37(PL2 (T5)) 38(PL3 (OC5A)) 39(PL4 (OC5B)) 40(PL5 (OC5C)) 41(PL6) 42(PL7) 43(PD0 (SCLINT0)) 44(PD1 (SDAINT1)) 45(PD2 (RXD1INT2)) 46(PD3 (TXD1INT3)) 47(PD4 (ICP1)) 48(PD5 (XCK1)) 49(PD6 (T1)) 50(PD7 (T0)) 51(PG0 (WR#)) 52(PG1 (RD#)) 53(PC0 (A8)) 54(PC1 (A9)) 55(PC2 (A10)) 56(PC3 (A11)) 57(PC4 (A12)) 58(PC5 (A13)) 59(PC6 (A14)) 60(PC7 (A15)) 61(VCC) 62(GND) 63(PJ0 (RXD3PCINT9)) 64(PJ1 (TXD3PCINT10)) 65(PJ2 (XCK3PCINT11)) 66(PJ3 (PCINT12)) 67(PJ4 (PCINT13)) 68(PJ5 (PCINT14)) 69(PJ6 (PCINT15)) 70(PG2 (ALE)) 71(PA7 (AD7)) 72(PA6 (AD6)) 73(PA5 (AD5)) 74(PA4 (AD4)) 75(PA3 (AD3)) 76(PA2 (AD2)) 77(PA1 (AD1)) 78(PA0 (AD0)) 79(PJ7) 80(VCC) 81(GND) 82(PK7 (ADC15PCINT23)) 83(PK6 (ADC14PCINT22)) 84(PK5 (ADC13PCINT21)) 85(PK4 (ADC12PCINT20)) 86(PK3 (ADC11PCINT19)) 87(PK2 (ADC10PCINT18)) 88(PK1 (ADC9PCINT17)) 89(PK0 (ADC8PCINT16)) 90(PF7 (ADC7TDI)) 91(PF6 (ADC6TDO)) 92(PF5 (ADC5TMS)) 93(PF4 (ADC4TCK)) 94(PF3 (ADC3)) 95(PF2 (ADC2)) 96(PF1 (ADC1)) 97(PF0 (ADC0)) 98(AREF) 99(GND) 100(AVCC); U6 6(NC)* 9(NC)*; U8 3(2A)* 4(2Y)* 5(3A)* 6(3Y)* 8(4Y)* 9(4A)* 12(6Y)* 13(6A)*; U12 2(2B)* 3(3B)* 4(4B)* 6(6B)* 7(7B)* 9(COM)* 10(7C)* 11(6C)* 13(4C)* 14(3C)* 15(2C)*; USB1 2(D-)* 3(D+)* 4(ID)*

## Notes on the sheets
sheet 1
- CIRCUIT CRYSYAL
sheet 4
- VARIABLES
- POWER INDICATOR
- DECOUPLING CAPACITOR
